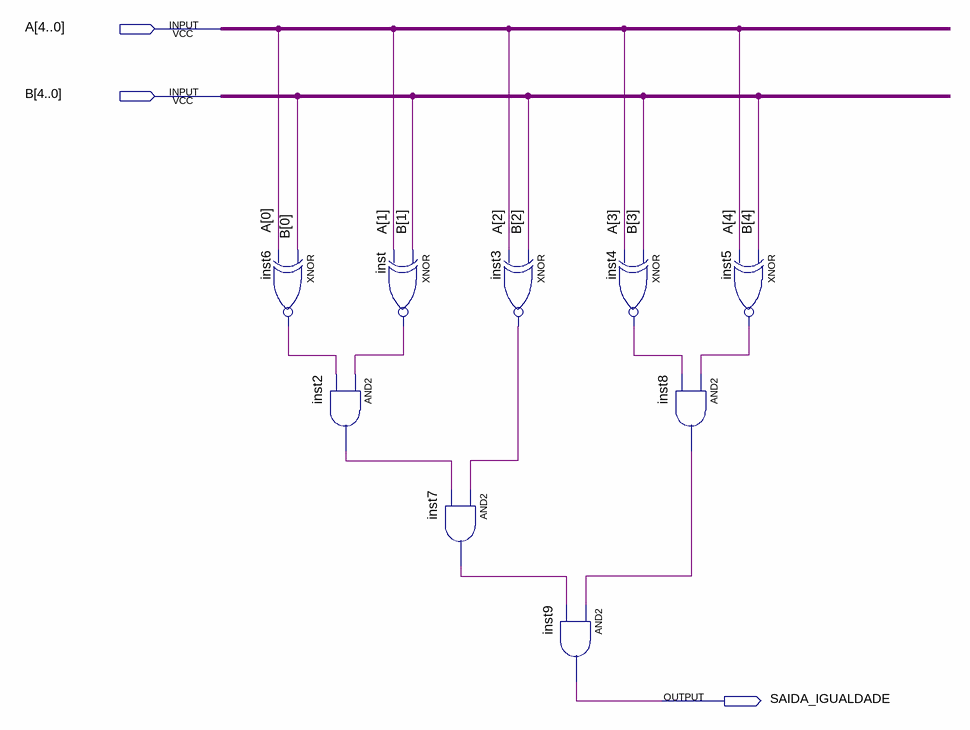
[diagram p0: schematic sheet]
// Quartus schematic modulo_igualdade.bdf as structural Verilog: 9 symbols, 3 pins
module modulo_igualdade (
  input  [4:0] A,
  input  [4:0] B,
  output SAIDA_IGUALDADE
);

  wire inst2_out, inst3_out, inst4_out, inst5_out, inst6_out, inst7_out, inst8_out, inst_out;

  xnor inst6 (inst6_out, B[0], A[0]);
  and inst2 (inst2_out, inst_out, inst6_out);
  xnor inst (inst_out, B[1], A[1]);
  and inst7 (inst7_out, inst3_out, inst2_out);
  xnor inst3 (inst3_out, B[2], A[2]);
  and inst9 (SAIDA_IGUALDADE, inst8_out, inst7_out);
  xnor inst4 (inst4_out, B[3], A[3]);
  and inst8 (inst8_out, inst5_out, inst4_out);
  xnor inst5 (inst5_out, B[4], A[4]);
endmodule
